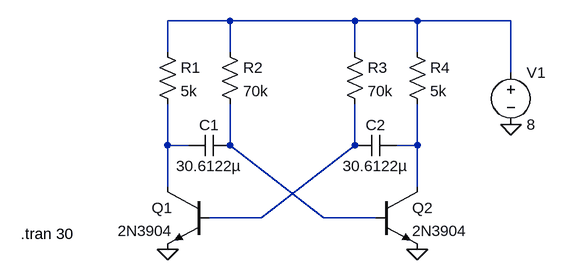
[diagram p0: schematic Draft1.asc]
Draft1.asc, the LTspice schematic file:
Version 4
SHEET 1 880 680
WIRE 144 -32 48 -32
WIRE 336 -32 144 -32
WIRE 432 -32 336 -32
WIRE 576 -32 432 -32
WIRE 48 16 48 -32
WIRE 144 16 144 -32
WIRE 336 16 336 -32
WIRE 432 16 432 -32
WIRE 576 48 576 -32
WIRE 48 160 48 96
WIRE 80 160 48 160
WIRE 144 160 144 96
WIRE 336 160 336 96
WIRE 432 160 432 96
WIRE 432 160 400 160
WIRE 48 224 48 160
WIRE 432 224 432 160
WIRE 192 272 336 160
WIRE 192 272 112 272
WIRE 288 272 144 160
WIRE 368 272 288 272
FLAG 48 320 0
FLAG 432 320 0
FLAG 576 128 0
SYMBOL npn 368 224 R0
SYMATTR InstName Q2
SYMATTR Value 2N3904
SYMBOL npn 112 224 M0
SYMATTR InstName Q1
SYMATTR Value 2N3904
SYMBOL res 32 0 R0
SYMATTR InstName R1
SYMATTR Value 5k
SYMBOL res 128 0 R0
SYMATTR InstName R2
SYMATTR Value 70k
SYMBOL res 320 0 R0
SYMATTR InstName R3
SYMATTR Value 70k
SYMBOL res 416 0 R0
SYMATTR InstName R4
SYMATTR Value 5k
SYMBOL cap 144 144 R90
WINDOW 0 0 32 VBottom 2
WINDOW 3 32 32 VTop 2
SYMATTR InstName C1
SYMATTR Value 30.6122µ
SYMBOL cap 400 144 R90
WINDOW 0 0 32 VBottom 2
WINDOW 3 32 32 VTop 2
SYMATTR InstName C2
SYMATTR Value 30.6122µ
SYMBOL voltage 576 32 R0
WINDOW 123 0 0 Left 0
WINDOW 39 0 0 Left 0
SYMATTR InstName V1
SYMATTR Value 8
TEXT -178 296 Left 2 !.tran 30

The netlist it stands for:
* Draft1.asc
Q2 N005 N003 0 0 2N3904
Q1 N002 N004 0 0 2N3904
R1 N001 N002 5k
R2 N001 N003 70k
R3 N001 N004 70k
R4 N001 N005 5k
C1 N003 N002 30.6122µ
C2 N005 N004 30.6122µ
V1 N001 0 8
.model NPN NPN
.model PNP PNP
.lib standard.bjt
.tran 30
.backanno
.end